# Altium schematic sheet can-rs232.SchDoc: can-rs232
size 582 x 469 mm; Origin: Eagle; Date: 4/18/2023 7:39:10 AM; SheetNumber: 1; GateName_1: G$1; SymbolName_1: FRAME_C_L; LibraryName: frames; DeviceSetName: FRAME_C_L; GateName_2: G$2; SymbolName_2: DOCFIELD; Sheet: Sheet:; REV: REV:
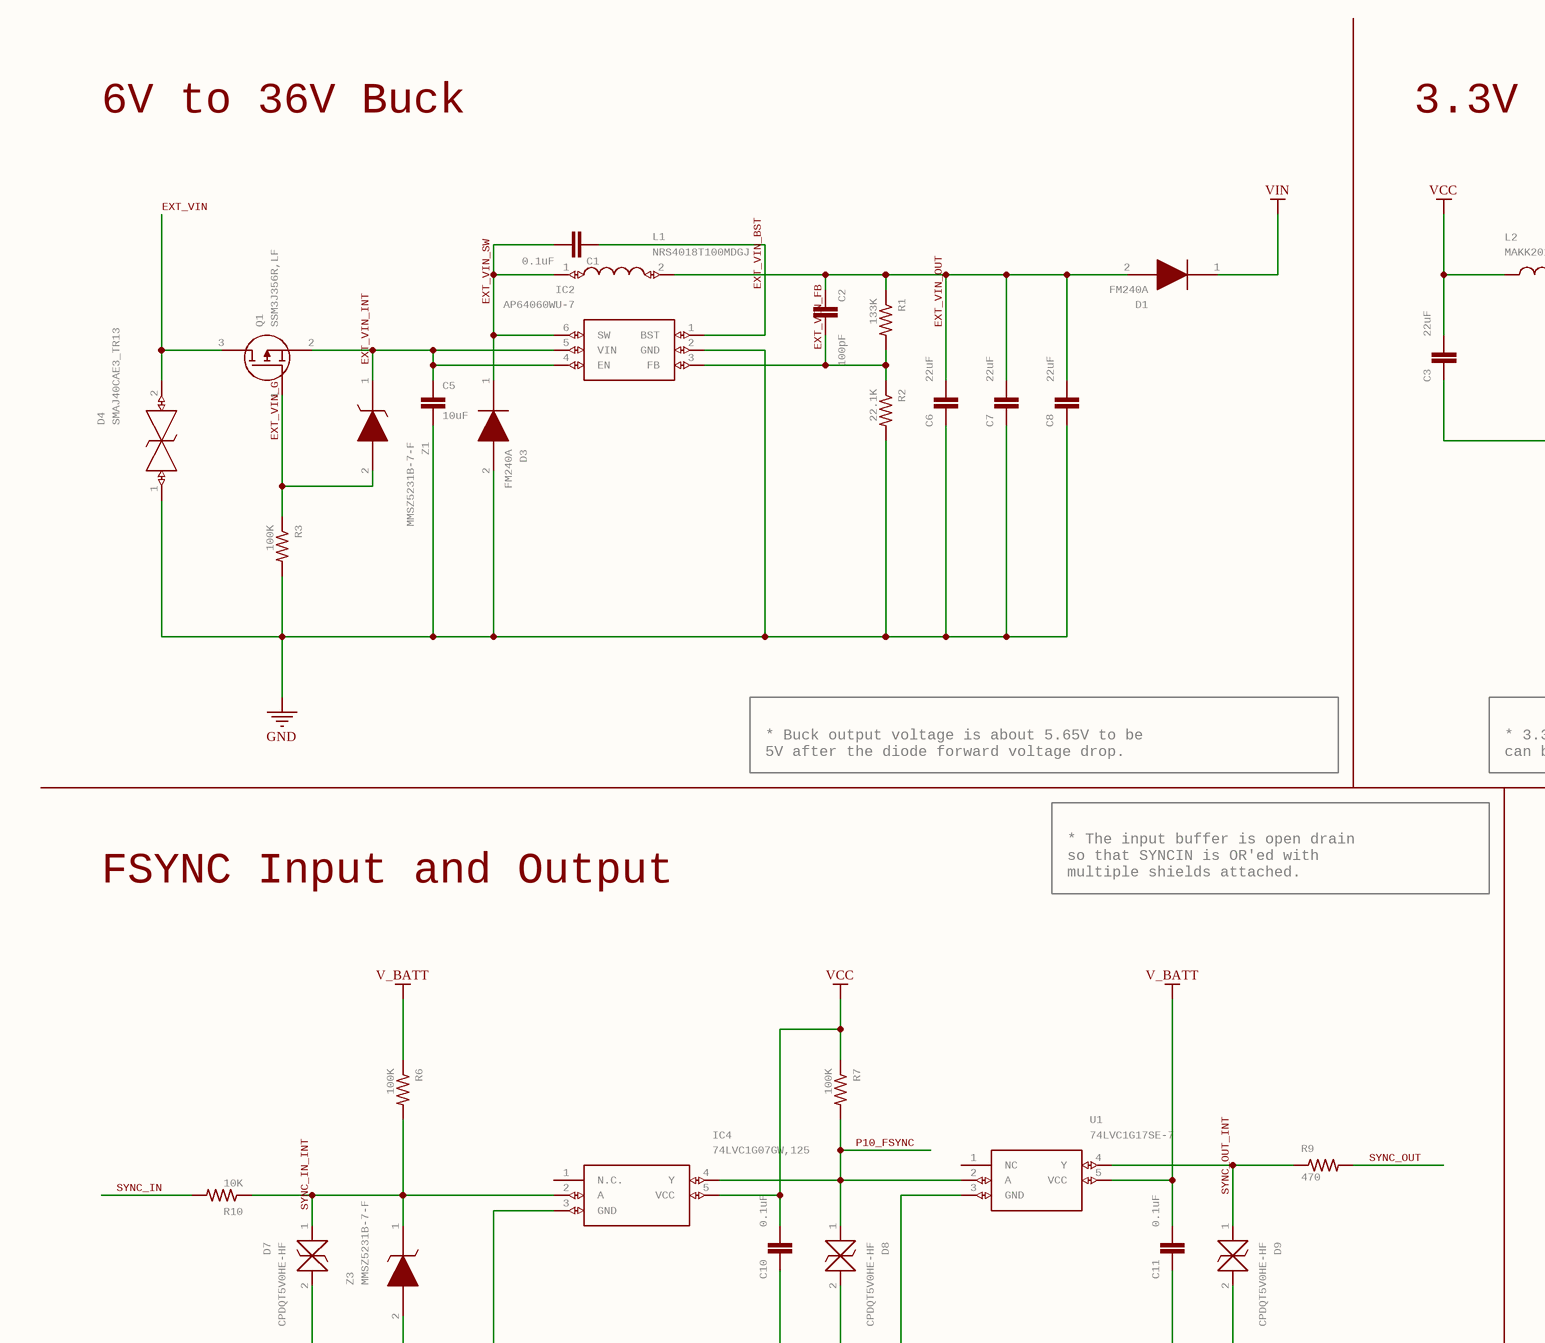
[diagram p0: can-rs232.SchDoc, top left]
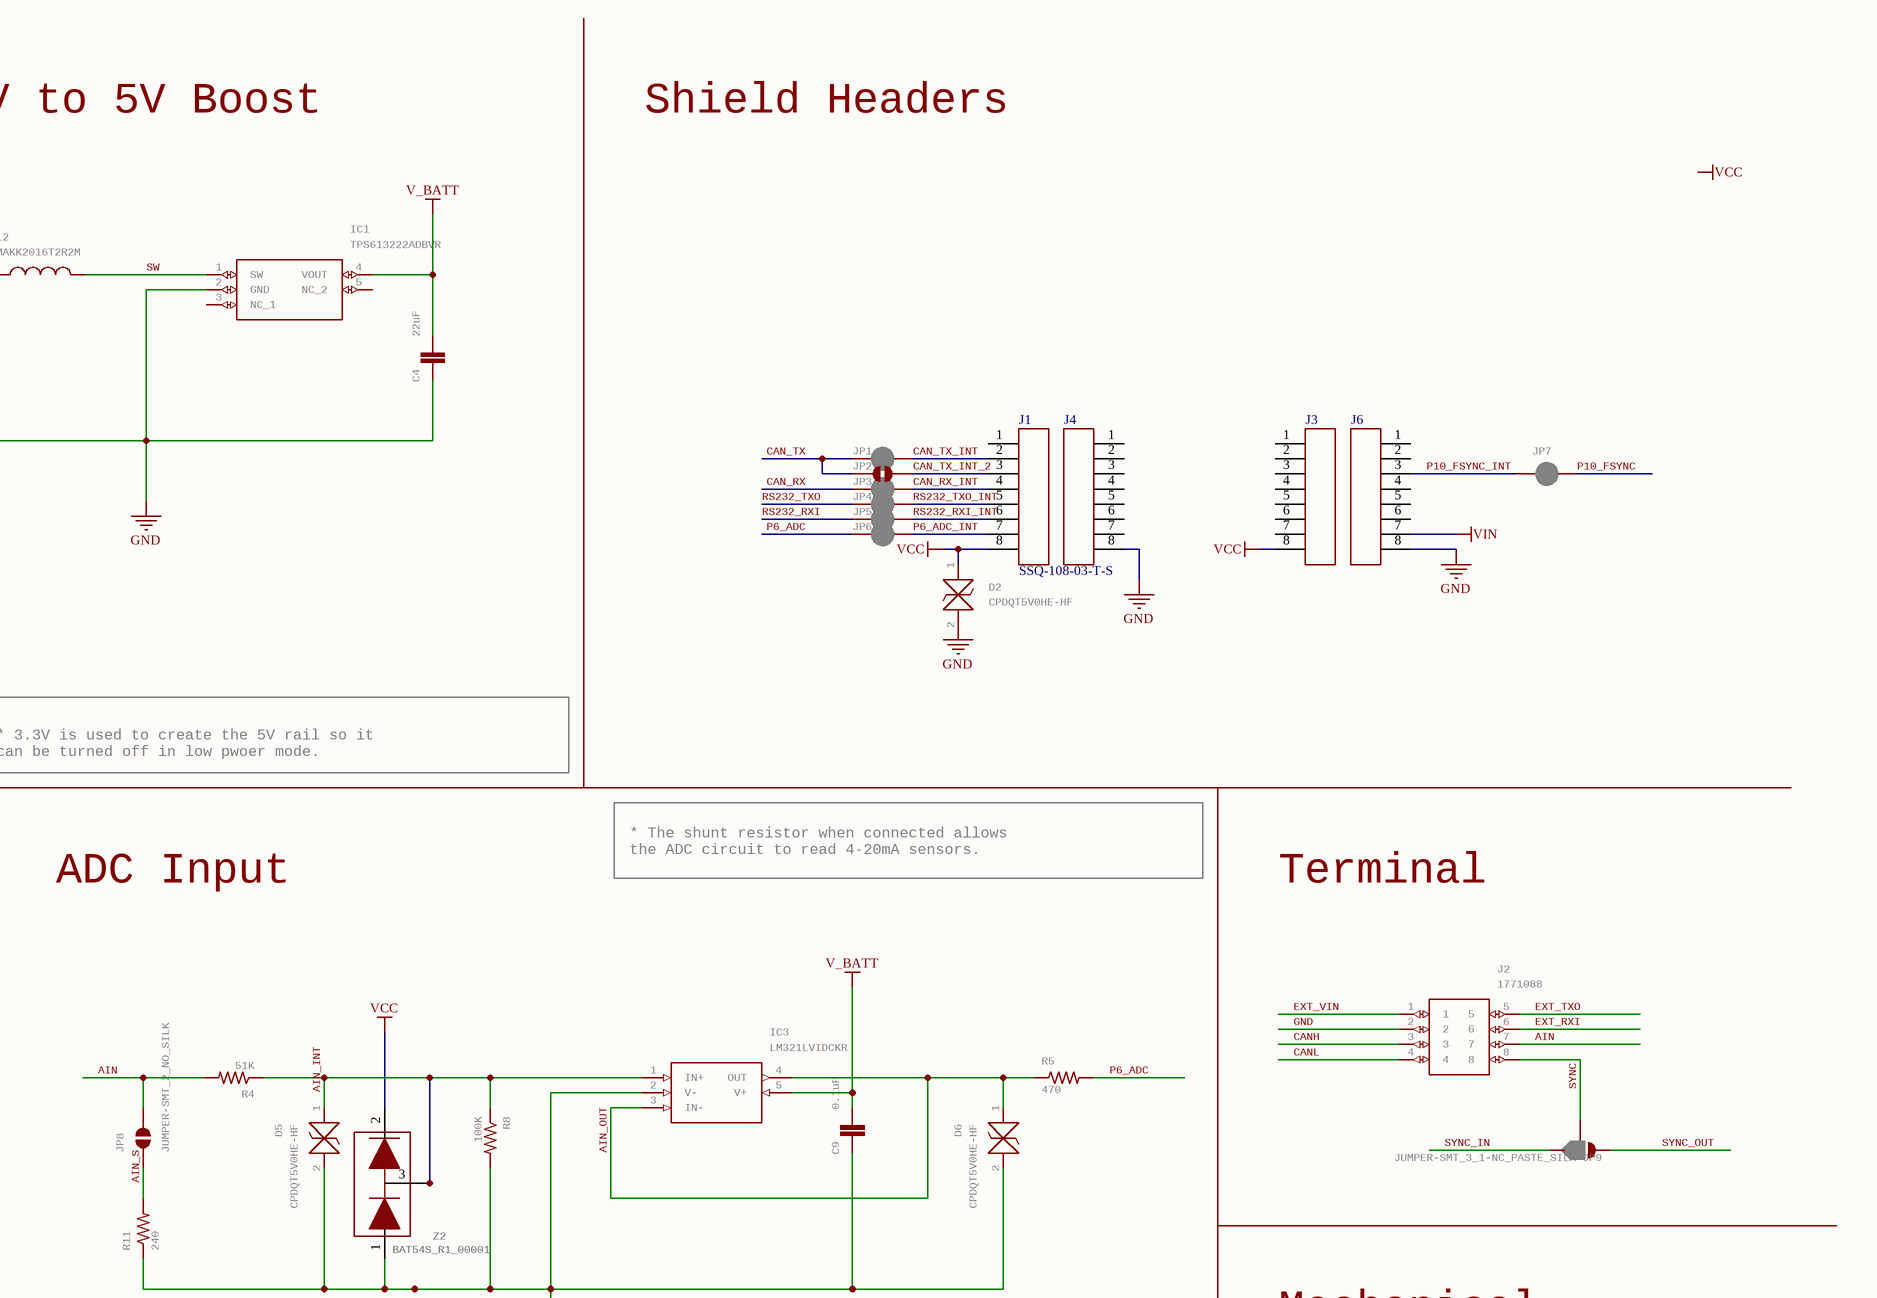
[diagram p1: can-rs232.SchDoc, top right]
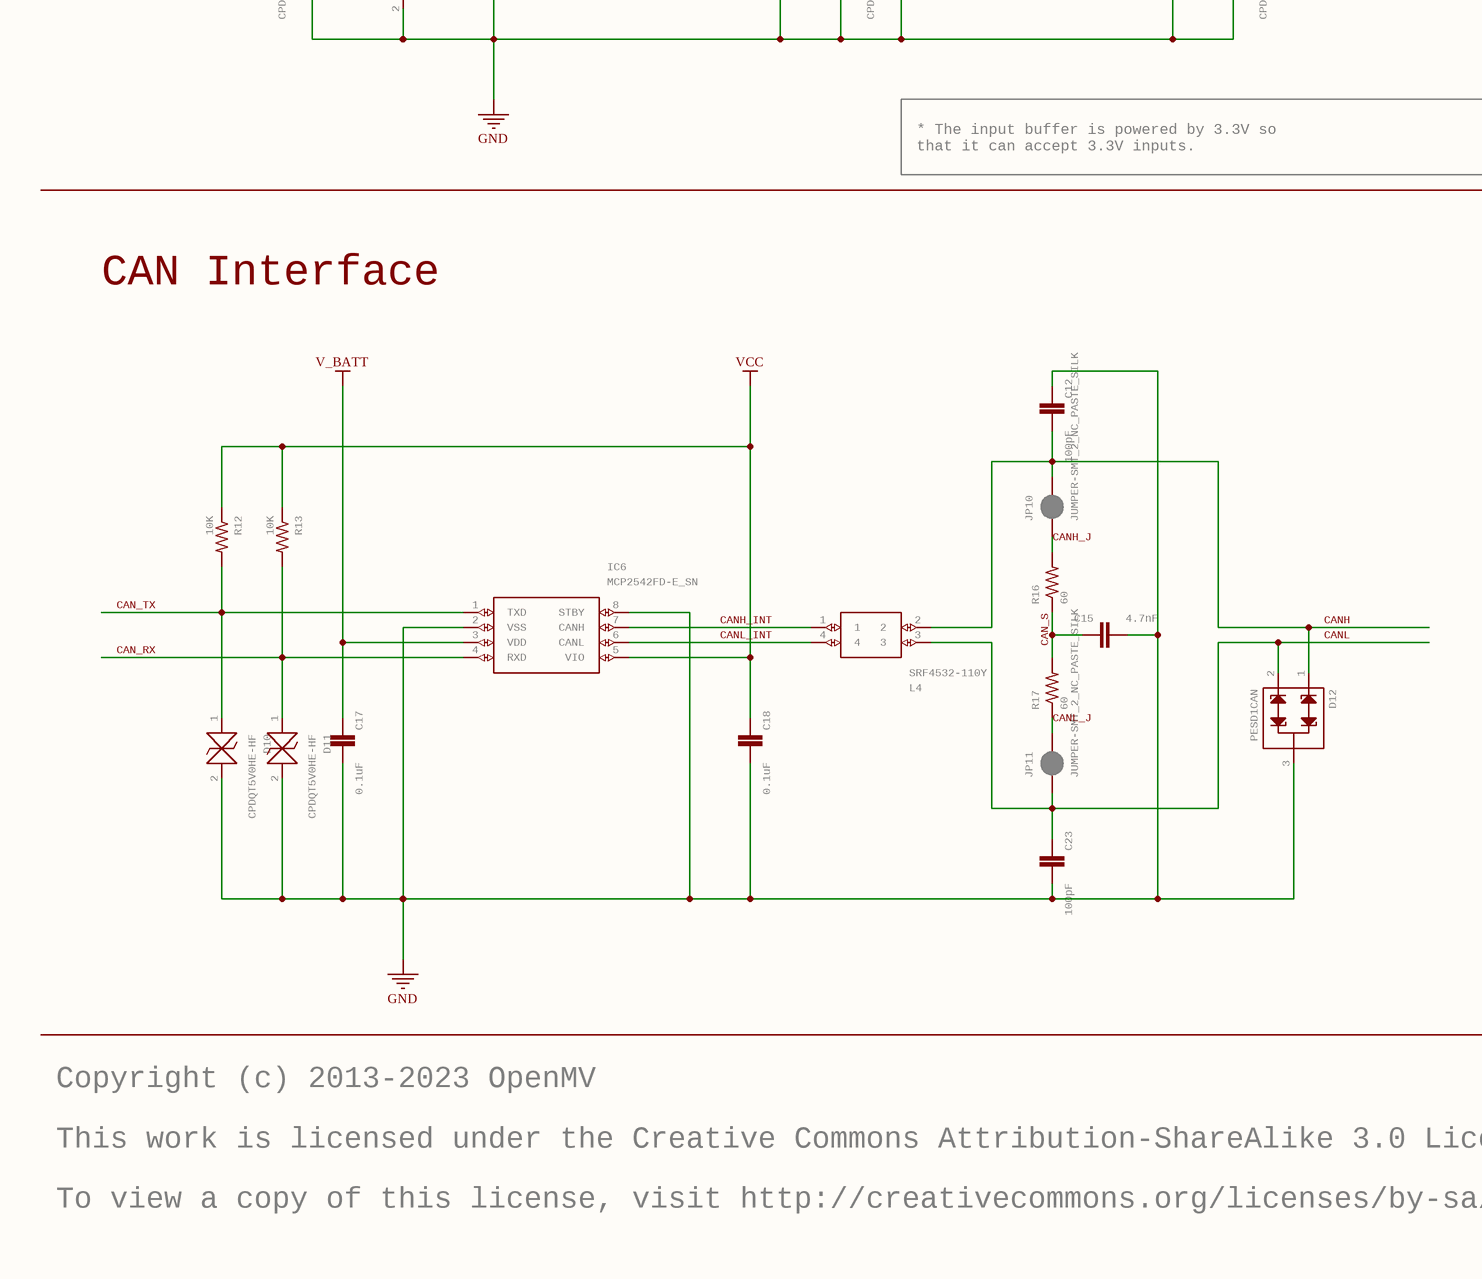
[diagram p2: can-rs232.SchDoc, bottom left]
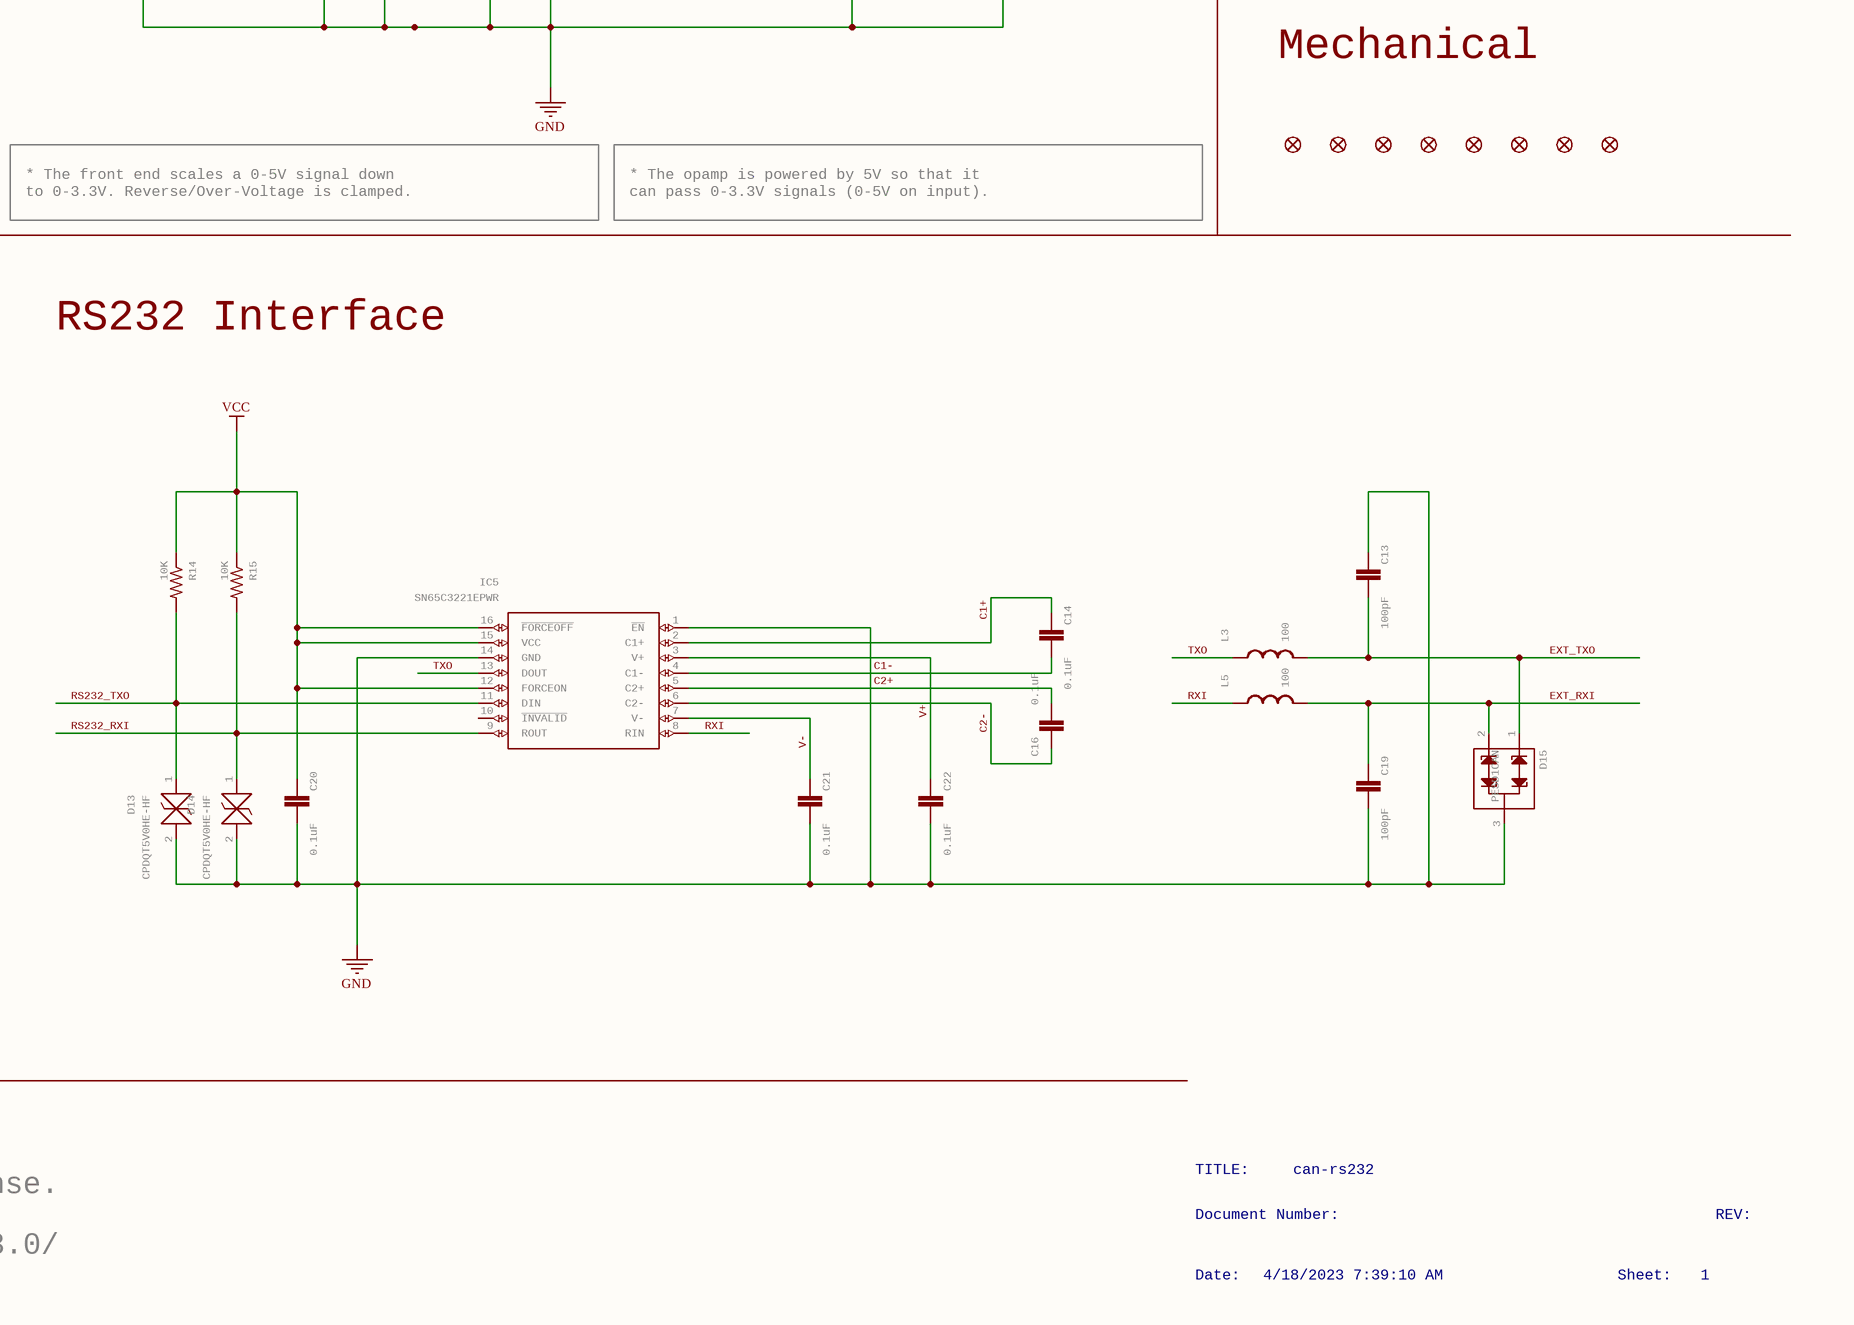
[diagram p3: can-rs232.SchDoc, bottom right]

## Parts
C1  0.1uF  [0402-CAP]
C2  100pF  [0402-CAP]
C3  22uF  [0805]
C4  22uF  [0805]
C5  10uF  [C0805]
C6  22uF  [0805]
C7  22uF  [0805]
C8  22uF  [0805]
C9  0.1uF  [0402-CAP]
C10  0.1uF  [0402-CAP]
C11  0.1uF  [0402-CAP]
C12  100pF  [0402-CAP]
C13  100pF  [0402-CAP]
C14  0.1uF  [0402-CAP]
C15  4.7nF  [0402-CAP]
C16  0.1uF  [0402-CAP]
C17  0.1uF  [0402-CAP]
C18  0.1uF  [0402-CAP]
C19  100pF  [0402-CAP]
C20  0.1uF  [0402-CAP]
C21  0.1uF  [0402-CAP]
C22  0.1uF  [0402-CAP]
C23  100pF  [0402-CAP]
D1  FM240A  [DIOM5025X231N]
D2  CPDQT5V0HE-HF  [CPDQT5V0HEHF]
D3  FM240A  [DIOM5025X231N]
D4  SMAJ40CAE3_TR13  [SMAJ40CAE3TR13]
D5  CPDQT5V0HE-HF  [CPDQT5V0HEHF]
D6  CPDQT5V0HE-HF  [CPDQT5V0HEHF]
D7  CPDQT5V0HE-HF  [CPDQT5V0HEHF]
D8  CPDQT5V0HE-HF  [CPDQT5V0HEHF]
D9  CPDQT5V0HE-HF  [CPDQT5V0HEHF]
D10  CPDQT5V0HE-HF  [CPDQT5V0HEHF]
D11  CPDQT5V0HE-HF  [CPDQT5V0HEHF]
D12  PESD1CAN  [SOT23-3]
D13  CPDQT5V0HE-HF  [CPDQT5V0HEHF]
D14  CPDQT5V0HE-HF  [CPDQT5V0HEHF]
D15  PESD1CAN  [SOT23-3]
FD1  FIDUCIAL1X2  [FIDUCIAL-1X2]  (value not drawn)
FD2  FIDUCIAL1X2  [FIDUCIAL-1X2]  (value not drawn)
FD3  FIDUCIAL1X2  [FIDUCIAL-1X2]  (value not drawn)
FD4  FIDUCIAL1X2  [FIDUCIAL-1X2]  (value not drawn)
FD5  FIDUCIAL1X2  [FIDUCIAL-1X2]  (value not drawn)
FD6  FIDUCIAL1X2  [FIDUCIAL-1X2]  (value not drawn)
FD7  FIDUCIAL1X2  [FIDUCIAL-1X2]  (value not drawn)
FD8  FIDUCIAL1X2  [FIDUCIAL-1X2]  (value not drawn)
IC1  TPS613222ADBVR  [SOT95P280X145-5N]
IC2  AP64060WU-7  [SOT95P280X100-6N]
IC3  LM321LVIDCKR  [SOT65P210X110-5N]
IC4  74LVC1G07GW,125  [SOT65P212X110-5N]
IC5  SN65C3221EPWR  [SOP65P640X120-16N]
IC6  MCP2542FD-E_SN  [SOIC127P600X175-8N]
J1  SSQ-108-03-T-S  [HDR_1X8]
J2  1771088  [1771088]
J3  SSQ-108-03-T-S  [HDR_1X8]  (value not drawn)
J4  SSQ-108-03-T-S  [HDR_1X8]  (value not drawn)
J6  SSQ-108-03-T-S  [HDR_1X8]  (value not drawn)
JP1  JUMPER-SMT_2_NC_PASTE_SILK  [SMT-JUMPER_2_NC_PASTE_SILK]  (value not drawn)
JP2  JUMPER-SMT_2_NO_SILK  [SMT-JUMPER_2_NO_SILK]  (value not drawn)
JP3  JUMPER-SMT_2_NC_PASTE_SILK  [SMT-JUMPER_2_NC_PASTE_SILK]  (value not drawn)
JP4  JUMPER-SMT_2_NC_PASTE_SILK  [SMT-JUMPER_2_NC_PASTE_SILK]  (value not drawn)
JP5  JUMPER-SMT_2_NC_PASTE_SILK  [SMT-JUMPER_2_NC_PASTE_SILK]  (value not drawn)
JP6  JUMPER-SMT_2_NC_PASTE_SILK  [SMT-JUMPER_2_NC_PASTE_SILK]  (value not drawn)
JP7  JUMPER-SMT_2_NC_PASTE_SILK  [SMT-JUMPER_2_NC_PASTE_SILK]  (value not drawn)
JP8  JUMPER-SMT_2_NO_SILK  [SMT-JUMPER_2_NO_SILK]
JP9  JUMPER-SMT_3_1-NC_PASTE_SILK  [SMT-JUMPER_3_1-NC_PASTE_SILK]
JP10  JUMPER-SMT_2_NC_PASTE_SILK  [SMT-JUMPER_2_NC_PASTE_SILK]
JP11  JUMPER-SMT_2_NC_PASTE_SILK  [SMT-JUMPER_2_NC_PASTE_SILK]
L1  NRS4018T100MDGJ  [NRS4018T100MDGJ]
L2  MAKK2016T2R2M  [INDC2016X100N]
L3  100  [C0402]
L4  SRF4532-110Y  [SRF4532101Y]
L5  100  [C0402]
Q1  SSM3J356R,LF  [SOTFL95P240X88-3N]
R1  133K  [0402-RES]
R2  22.1K  [0402-RES]
R3  100K  [0402-RES]
R4  51K  [0402-RES]
R5  470  [R0603]
R6  100K  [0402-RES]
R7  100K  [0402-RES]
R8  100K  [0402-RES]
R9  470  [R0603]
R10  10K  [0402-RES]
R11  240  [R0603]
R12  10K  [0402-RES]
R13  10K  [0402-RES]
R14  10K  [0402-RES]
R15  10K  [0402-RES]
R16  60  [R1206]
R17  60  [R1206]
U1  74LVC1G17SE-7  [SOT65P210X110-5N]
Z1  MMSZ5231B-7-F  [SOD3716X145N]
Z2  BAT54S_R1_00001  [SOT23-3]
Z3  MMSZ5231B-7-F  [SOD3716X145N]

## Nets
GND: C3.1 C4.1 C5.2 C6.1 C7.1 C8.1 C9.1 C10.1 C11.1 C12.1 C13.1 C15.2 C17.2 C18.2 C19.2 C20.2 C21.2 C22.2 C23.2 D2.2 D3.2(A) D4.1 D5.2 D6.2 D7.2 D8.2 D9.2 D10.2 D11.2 D12.3 D13.2 D14.2 D15.3 IC1.2(GND) IC2.2(GND) IC3.2(V-) IC4.3(GND) IC5.1(~{EN}) IC5.14(GND) IC6.2(VSS) IC6.8(STBY) J2.2 J4.8 J6.8 R2.2 R3.2 R8.2 R11.1 U1.3(GND) Z2.1 Z3.2(A)
V_BATT: C4.2 C9.2 C11.2 C17.1 IC1.4(VOUT) IC3.5(V+) IC6.3(VDD) R6.1 U1.5(VCC)
VCC: C3.2 C10.2 C18.1 C20.1 D2.1 IC4.5(VCC) IC5.12(FORCEON) IC5.15(VCC) IC5.16(~{FORCEOFF}) IC6.5(VIO) J1.8 J3.8 L2.1 R7.1 R12.1 R13.1 R14.1 R15.1 Z2.2
VIN: D1.1(K) J6.7
AIN: J2.7 JP8.2 R4.2
AIN_INT: D5.1 IC3.1(IN+) R4.1 R8.1 Z2.3
AIN_OUT: D6.1 IC3.3(IN-) IC3.4(OUT) R5.1
AIN_S: JP8.1 R11.2
C1+: C14.1 IC5.2(C1+)
C1-: C14.2 IC5.4(C1-)
C2+: C16.2 IC5.5(C2+)
C2-: C16.1 IC5.6(C2-)
CAN_RX: D11.1 IC6.4(RXD) JP3.1 R13.2
CAN_RX_INT: J1.4 JP3.2
CAN_S: C15.1 R16.1 R17.2
CAN_TX: D10.1 IC6.1(TXD) JP1.2 JP2.2 R12.2
CAN_TX_INT: J1.2 JP1.1
CAN_TX_INT_2: J1.3 JP2.1
CANH: C12.2 D12.1 J2.3 JP10.2 L4.2
CANH_INT: IC6.7(CANH) L4.1
CANH_J: JP10.1 R16.2
CANL: C23.1 D12.2 J2.4 JP11.1 L4.3
CANL_INT: IC6.6(CANL) L4.4
CANL_J: JP11.2 R17.1
EXT_RXI: C19.1 D15.2 J2.6 L5.2
EXT_TXO: C13.2 D15.1 J2.5 L3.2
EXT_VIN: D4.2 J2.1 Q1.3(D)
EXT_VIN_BST: C1.1 IC2.1(BST)
EXT_VIN_FB: C2.2 IC2.3(FB) R1.2 R2.1
EXT_VIN_G: Q1.1(G) R3.1 Z1.2(A)
EXT_VIN_INT: C5.1 IC2.4(EN) IC2.5(VIN) Q1.2(S) Z1.1(K)
EXT_VIN_OUT: C2.1 C6.2 C7.2 C8.2 D1.2(A) L1.2 R1.1
EXT_VIN_SW: C1.2 D3.1(K) IC2.6(SW) L1.1
P6_ADC: JP6.2 R5.2
P6_ADC_INT: J1.7 JP6.1
P10_FSYNC: D8.1 IC4.4(Y) JP7.2 R7.2 U1.2(A)
P10_FSYNC_INT: J6.3 JP7.1
RS232_RXI: D14.1 IC5.9(ROUT) JP5.2 R15.2
RS232_RXI_INT: J1.6 JP5.1
RS232_TXO: D13.1 IC5.11(DIN) JP4.2 R14.2
RS232_TXO_INT: J1.5 JP4.1
RXI: IC5.8(RIN) L5.1
SW: IC1.1(SW) L2.2
SYNC: J2.8 JP9.2
SYNC_IN: JP9.3 R10.2
SYNC_IN_INT: D7.1 IC4.2(A) R6.2 R10.1 Z3.1(K)
SYNC_OUT: JP9.1 R9.2
SYNC_OUT_INT: D9.1 R9.1 U1.4(Y)
TXO: IC5.13(DOUT) L3.1
V+: C22.1 IC5.3(V+)
V-: C21.1 IC5.7(V-)

Not connected (* = marked no-connect by the designer): IC1 3(NC_1) 5(NC_2); IC4 1(N.C.); IC5 10(~{INVALID}); J1 1; J3 1 2 3 4 5 6 7; J4 1 2 3 4 5 6 7; J6 1 2 4 5 6; U1 1(NC)

## Notes on the sheet
- 6V to 36V Buck
- 3.3V to 5V Boost
- Shield Headers
- * Buck output voltage is about 5.65V to be
  5V after the diode forward voltage drop.
- * 3.3V is used to create the 5V rail so it
  can be turned off in low pwoer mode.
- * The shunt resistor when connected allows
  the ADC circuit to read 4-20mA sensors.
- FSYNC Input and Output
- * The input buffer is open drain
  so that SYNCIN is OR'ed with
  multiple shields attached.
- ADC Input
- Terminal
- Mechanical
- * The input buffer is powered by 3.3V so
  that it can accept 3.3V inputs.
- * The front end scales a 0-5V signal down
  to 0-3.3V. Reverse/Over-Voltage is clamped.
- * The opamp is powered by 5V so that it
  can pass 0-3.3V signals (0-5V on input).
- CAN Interface
- RS232 Interface
- Copyright (c) 2013-2023 OpenMV
- TITLE:
- can-rs232
- This work is licensed under the Creative Commons Attribution-ShareAlike 3.0 License.
- To view a copy of this license, visit http://creativecommons.org/licenses/by-sa/3.0/
- Document Number:
- REV:
- Date:
- 4/18/2023 7:39:10 AM
- Sheet:
- 1
- Labels drawn without touching a wire or pin: VCC

## Library data of the parts
C1 C9-C11 C14 C16-C18 C20-C22 = CAP0402-CAP: CapacitorStandard 0603 ceramic capacitor, and 0.1" leaded capacitor.; MPN: GRM155R71H104KE14D; GateName_1: G$1; SymbolName_1: CAP; DeviceName: 0402-CAP; LibraryName: sfe; DeviceSetName: CAP
C2 C12 C13 C19 C23 = CAP0402-CAP: CapacitorStandard 0603 ceramic capacitor, and 0.1" leaded capacitor.; MPN: CC0402JRNPO9BN101; GateName_1: G$1; SymbolName_1: CAP; DeviceName: 0402-CAP; LibraryName: sfe; DeviceSetName: CAP
C3 C4 C6-C8 = 22UF-0805-6.3V-20%: 22ÂµF ceramic capacitors    A capacitor is a passive two-terminal electrical component used to store electrical energy temporarily in an electric field.; MPN: CL21A226MQQNNNE; GateName_1: G$1; SymbolName_1: CAP; PROD_ID: CAP-08402; DeviceName: -0805-6.3V-20%; LibraryName: SparkFun-Capacitors; DeviceSetName: 22UF
C5 = C-EUC0805: CAPACITOR, European symbol; MPN: GRM21BR61H106KE43K; GateName_1: G$1; SymbolName_1: C-EU; POPULARITY: 88; DeviceName: C0805; LibraryName: rcl; DeviceSetName: C-EU; SPICEPREFIX: C
C15 = CAP0402-CAP: CapacitorStandard 0603 ceramic capacitor, and 0.1" leaded capacitor.; MPN: GRM155R71H472JA01D; GateName_1: G$1; SymbolName_1: CAP; DeviceName: 0402-CAP; LibraryName: sfe; DeviceSetName: CAP
D1 D3 = FM240A: Diodes - General Purpose, Power, Switching GP Si Rectifier SMB,2A,40V   Source:  Datasheet; MANUFACTURER_NAME: Rectron; GateName_1: G$1; SymbolName_1: FM240A; LibraryName: FM240A; DeviceSetName: FM240A; HEIGHT: 2.31mm; MANUFACTURER_PART_NUMBER: FM240A; MOUSER_PART_NUMBER: 583-FM240A; MOUSER_PRICE-STOCK: https://www.mouser.co.uk/ProductDetail/Rectron/FM240A?qs=7pEAo90IqNG7sknZwmLYhQ%3D%3D; MPN: FM240A
D2 D5-D11 D13 D14 = CPDQT5V0HE-HF: ESD Suppressors / TVS Diodes DIODE ESD 5VWM 65W 0402/SOD-923F   Source:  Datasheet; MANUFACTURER_NAME: Comchip Technology; GateName_1: G$1; SymbolName_1: CPDQT5V0HE-HF; LibraryName: CPDQT5V0HE-HF; DeviceSetName: CPDQT5V0HE-HF; HEIGHT: 0.42mm; MANUFACTURER_PART_NUMBER: CPDQT5V0HE-HF; MOUSER_PART_NUMBER: MOUSER_PART_NUMBER; MOUSER_PRICE-STOCK: MOUSER_PRICE-STOCK; MPN: CPDQT5V0HE-HF
D4 = SMAJ40CAE3_TR13: ESD Suppressors / TVS Diodes TVS   Source:  Datasheet; MANUFACTURER_NAME: Microchip; MANUFACTURER_PART_NUMBER: SMAJ40CAe3/TR13; GateName_1: G$1; SymbolName_1: SMAJ40CAE3_TR13; LibraryName: SMAJ40CAe3_TR13; DeviceSetName: SMAJ40CAE3_TR13; HEIGHT: 3.05mm; MOUSER_PART_NUMBER: 494-SMAJ40CAE3/TR13; MOUSER_PRICE-STOCK: https://www.mouser.co.uk/ProductDetail/Microchip-Technology/SMAJ40CAe3-TR13?qs=pU29NIZ4ZwCw3PnlxOleOw%3D%3D; MPN: SMAJ40CAe3/TR13
D12 D15 = PESD1CAN: CAN bus ESD protection diode    PESD1CAN is used to protect two CAN bus lines from ESD.   Link to datasheet   SparkFun Products: SparkFun CAN-BUS Shield; MPN: VCAN36A2-03S-E3-08; GateName_1: G$1; SymbolName_1: PESD1CAN_DIODE; PROD_ID: DIO-12501; LibraryName: SparkFun-DiscreteSemi; DeviceSetName: PESD1CAN
FD1-FD8 = FIDUCIAL1X2: Fiducial Alignment Points    Point-of-reference for pick-and-place machines and other optical instruments.; GateName_1: G$1; DeviceName: 1X2; SymbolName_1: FIDUCIAL; LibraryName: SparkFun-Aesthetics; DeviceSetName: FIDUCIAL
IC1 = TPS613222ADBVR: 6-uA Quiescent Current, 1.8-A Switch Current Boost Converter   Source:  Datasheet; MANUFACTURER_NAME: Texas Instruments; GateName_1: G$1; SymbolName_1: TPS613222ADBVR; LibraryName: TPS613222ADBVR; DeviceSetName: TPS613222ADBVR; HEIGHT: 1.45mm; MANUFACTURER_PART_NUMBER: TPS613222ADBVR; MOUSER_PART_NUMBER: 595-TPS613222ADBVR; MOUSER_PRICE-STOCK: https://www.mouser.co.uk/ProductDetail/Texas-Instruments/TPS613222ADBVR?qs=W0yvOO0ixfE4d69WXsn8NQ%3D%3D; MPN: TPS613222ADBVR
IC2 = AP64060WU-7: Switching Voltage Regulators DCDC Conv HV Buck TSOT26(STD) T&R 3K   Source:  Datasheet; MANUFACTURER_NAME: Diodes Inc.; GateName_1: G$1; SymbolName_1: AP64060WU-7; LibraryName: AP64060WU-7; DeviceSetName: AP64060WU-7; HEIGHT: 1mm; MANUFACTURER_PART_NUMBER: AP64060WU-7; MOUSER_PART_NUMBER: 621-AP64060WU-7; MOUSER_PRICE-STOCK: https://www.mouser.co.uk/ProductDetail/Diodes-Incorporated/AP64060WU-7?qs=Li%252BoUPsLEntiZYjFw%252BCbiQ%3D%3D; MPN: AP64060WU-7
IC3 = LM321LVIDCKR: 1-Channel industry standard low voltage operational amplifier   Source:  Datasheet; MANUFACTURER_NAME: Texas Instruments; GateName_1: G$1; SymbolName_1: LM321LVIDCKR; LibraryName: LM321LVIDCKR; DeviceSetName: LM321LVIDCKR; HEIGHT: 1.1mm; MANUFACTURER_PART_NUMBER: LM321LVIDCKR; MOUSER_PART_NUMBER: 595-LM321LVIDCKR; MOUSER_PRICE-STOCK: https://www.mouser.co.uk/ProductDetail/Texas-Instruments/LM321LVIDCKR?qs=qSfuJ%252Bfl%2Fd6RcyTOjkRx5Q%3D%3D; MPN: LM321LVIDCKR
IC4 = 74LVC1G07GW,125: 74LVC1G07 - Buffer with open-drain output@en-us   Source:  Datasheet; MANUFACTURER_NAME: Nexperia; GateName_1: G$1; SymbolName_1: 74LVC1G07GW,125; LibraryName: 74LVC1G07GW_125; DeviceSetName: 74LVC1G07GW,125; HEIGHT: 1.1mm; MANUFACTURER_PART_NUMBER: 74LVC1G07GW,125; MOUSER_PART_NUMBER: 771-74LVC1G07GW-G; MOUSER_PRICE-STOCK: https://www.mouser.co.uk/ProductDetail/Nexperia/74LVC1G07GW125?qs=me8TqzrmIYW763Mg%2FG86Uw%3D%3D; MPN: 74LVC1G07GW,125
IC5 = SN65C3221EPWR: 3-V To 5.5-V Single Channel RS-232 1 Mbit/s Line Driver/Receiver   Source:  Datasheet; MANUFACTURER_NAME: Texas Instruments; GateName_1: G$1; SymbolName_1: SN65C3221EPWR; LibraryName: SN65C3221EPWR; DeviceSetName: SN65C3221EPWR; HEIGHT: 1.2mm; MANUFACTURER_PART_NUMBER: SN65C3221EPWR; MOUSER_PART_NUMBER: 595-SN65C3221EPWR; MOUSER_PRICE-STOCK: https://www.mouser.co.uk/ProductDetail/Texas-Instruments/SN65C3221EPWR?qs=6siQ5y5nVCwNDulozFTH8A%3D%3D; MPN: SN65C3221EPWR
IC6 = MCP2542FD-E_SN: Microchip MCP2542FD-E/SN, CAN Transceiver 8Mbit/s 1-Channel CAN, ISO 11898-2, ISO 11898-5, ISO/DIS11898-2, 8-Pin SOIC   Source:  Datasheet; GateName_1: G$1; SymbolName_1: MCP2542FD-E_SN; LibraryName: MCP2542FD-E_SN; DeviceSetName: MCP2542FD-E_SN; HEIGHT: 1.75mm; MANUFACTURER_NAME: Microchip; MANUFACTURER_PART_NUMBER: MCP2542FD-E/SN; MOUSER_PART_NUMBER: 579-MCP2542FD-E/SN; MOUSER_PRICE-STOCK: https://www.mouser.co.uk/ProductDetail/Microchip-Technology-Atmel/MCP2542FD-E-SN?qs=qdgZG5p0FZ5pNizBl1u80Q%3D%3D; MPN: MCP2542FD-E/SN
J1 J3 J4 J6 = HDR_1X8: MANUFACTURER P/N: SSQ-108-03-T-S
J2 = 1771088: PCB terminal block, nominal current: 6 A, rated voltage (III/2): 160 V, nominal cross section: 0.5 mm?, Number of potentials: 8, Number of rows: 1, Number of positions per row: 8, product range: PTSM 0,5/..-H-SMD, pitch: 2.5 mm, connection method: Push-in spring connection, mounting: SMD soldering, conductor/PCB connection direction: 0 ?, color: black, Pin layout: Linear pad geometry, type of packaging: packed in cardboard   Source:  Datasheet; MANUFACTURER_NAME: Phoenix Contact; GateName_1: G$1; SymbolName_1: 1771088; LibraryName: 1771088; DeviceSetName: 1771088; HEIGHT: 5.22mm; MANUFACTURER_PART_NUMBER: 1771088; MOUSER_PART_NUMBER: 651-1771088; MOUSER_PRICE-STOCK: https://www.mouser.co.uk/ProductDetail/Phoenix-Contact/1771088?qs=Q77YN%2FRrsKIDMojcNKtpFQ%3D%3D; MPN: 1771088
JP1 JP3-JP7 JP10 JP11 = JUMPER-SMT_2_NC_PASTE_SILK: Normally closed solder jumper    This jumper has an aperture in the stencil to allow solder paste to bridge the split in the wire so it's normally closed (NC). Wick off the solder to open the connection. Reapply solder to reclose the connection.; GateName_1: G$1; SymbolName_1: SMT-JUMPER_2_NC_PASTE; DeviceName: _SILK; LibraryName: SparkFun-Jumpers; DeviceSetName: JUMPER-SMT_2_NC_PASTE
JP2 JP8 = JUMPER-SMT_2_NO_SILK: Normally open jumper    This jumper has two pads in close proximity to each other. Apply solder to close the connection.   Round pads are easier to solder for beginners, but are a lot larger.   SparkFun Product that uses the round pads:  SparkFun EL Sequencer; GateName_1: G$1; SymbolName_1: SMT-JUMPER_2_NO; DeviceName: _SILK; LibraryName: SparkFun-Jumpers; DeviceSetName: JUMPER-SMT_2_NO
JP9 = JUMPER-SMT_3_1-NC_PASTE_SILK: Normally closed solder jumper (1 of 2 connections)    This jumper has an aperture in the stencil to allow solder paste to bridge one of the two connections. One connection is normally closed (NC), while the other is normally open (NO). Wick off the solder to open the connection. Reapply solder to reclose the connection. Apply solder to the other side instead to change the current path.; GateName_1: G$1; SymbolName_1: SMT-JUMPER_3_1-NC_PASTE; DeviceName: _SILK; LibraryName: SparkFun-Jumpers; DeviceSetName: JUMPER-SMT_3_1-NC_PASTE
L1 = NRS4018T100MDGJ: Fixed Inductors 4018 10uH 180mOhms +/-20%Tol 1200mA   Source:  Datasheet; MANUFACTURER_NAME: TAIYO YUDEN; GateName_1: G$1; SymbolName_1: NRS4018T100MDGJ; LibraryName: NRS4018T100MDGJ; DeviceSetName: NRS4018T100MDGJ; HEIGHT: 1mm; MANUFACTURER_PART_NUMBER: NRS4018T100MDGJ; MOUSER_PART_NUMBER: 963-NRS4018T100MDGJ; MOUSER_PRICE-STOCK: https://www.mouser.co.uk/ProductDetail/TAIYO-YUDEN/NRS4018T100MDGJ?qs=PzICbMaShUeiyHfvjt6KEw%3D%3D; MPN: NRS4018T100MDGJ
L2 = MAKK2016T2R2M: INDUCTOR, METAL CORE Check availability; GateName_1: G$1; MF: Taiyo Yuden; SymbolName_1: MAKK2016T2R2M; LibraryName: MAKK2016T2R2M; DeviceSetName: MAKK2016T2R2M; AVAILABILITY: In Stock; MP: MAKK2016T2R2M; MPN: MAKK2016T2R2M; PACKAGE: 2016 Taiyo Yuden; PRICE: None; PURCHASE-URL: https://pricing.snapeda.com/search/part/MAKK2016T2R2M/?ref=eda
L3 L5 = INDUCTOR0402: InductorsBasic Inductor/Choke - 0603 and 1206. Footprints are not proven and vary greatly between part numbers.; MPN: MFBM1V1005-101-R; GateName_1: G$1; DeviceName: 0402; SymbolName_1: INDUCTOR; LibraryName: sfe; DeviceSetName: INDUCTOR
L4 = SRF4532-110Y: Bourns Type 4532 Wire-wound SMD Inductor with a Ferrite Core, 11 uH -30  +50% Wire-Wound 300mA Idc   Source:  Datasheet; GateName_1: G$1; SymbolName_1: SRF4532-110Y; LibraryName: SRF4532-110Y; DeviceSetName: SRF4532-110Y; HEIGHT: 3mm; MANUFACTURER_NAME: Bourns; MANUFACTURER_PART_NUMBER: SRF4532-110Y; MOUSER_PART_NUMBER: 652-SRF4532-110Y; MOUSER_PRICE-STOCK: https://www.mouser.co.uk/ProductDetail/Bourns/SRF4532-110Y?qs=u649AIwumF8o5t6hcAfmlw%3D%3D; MPN: SRF4532-110Y
Q1 = SSM3J356R,LF: MOSFET Small-signal MOSFET ID: -2A, VDSS: -60V   Source:  Datasheet; MANUFACTURER_NAME: Toshiba; GateName_1: G$1; SymbolName_1: SSM3J356R,LF; LibraryName: SSM3J356R_LF; DeviceSetName: SSM3J356R,LF; HEIGHT: 0.88mm; MANUFACTURER_PART_NUMBER: SSM3J356R,LF; MOUSER_PART_NUMBER: 757-SSM3J356RLF; MOUSER_PRICE-STOCK: https://www.mouser.co.uk/ProductDetail/Toshiba/SSM3J356RLF?qs=lhkzy8lC%252BSsL%2F1yLGjMnQA%3D%3D; MPN: SSM3J356R,LF
R1 = RESISTOR0402-RES: ResistorBasic schematic elements and footprints for 0603, 1206, and PTH resistors.; MPN: RC0402FR-07133KL; GateName_1: G$1; SymbolName_1: RESISTOR; DeviceName: 0402-RES; LibraryName: sfe; DeviceSetName: RESISTOR
R2 = RESISTOR0402-RES: ResistorBasic schematic elements and footprints for 0603, 1206, and PTH resistors.; MPN: CR0402-FX-2212GLF; GateName_1: G$1; SymbolName_1: RESISTOR; DeviceName: 0402-RES; LibraryName: sfe; DeviceSetName: RESISTOR
R3 R6-R8 = RESISTOR0402-RES: ResistorBasic schematic elements and footprints for 0603, 1206, and PTH resistors.; MPN: AC0402FR-07100KL; GateName_1: G$1; SymbolName_1: RESISTOR; DeviceName: 0402-RES; LibraryName: sfe; DeviceSetName: RESISTOR
R4 = RESISTOR0402-RES: ResistorBasic schematic elements and footprints for 0603, 1206, and PTH resistors.; MPN: RC0402JR-0751KL; GateName_1: G$1; SymbolName_1: RESISTOR; DeviceName: 0402-RES; LibraryName: sfe; DeviceSetName: RESISTOR
R5 R9 = R-US_R0603: RESISTOR, American symbol; MPN: CR0603-FX-4700ELF; GateName_1: G$1; SymbolName_1: R-US; DeviceSetName: R-US_; POPULARITY: 77; DeviceName: R0603; LibraryName: rcl; SPICEPREFIX: R
R10 R12-R15 = RESISTOR0402-RES: ResistorBasic schematic elements and footprints for 0603, 1206, and PTH resistors.; MPN: AC0402FR-1310KL; GateName_1: G$1; SymbolName_1: RESISTOR; DeviceName: 0402-RES; LibraryName: sfe; DeviceSetName: RESISTOR
R11 = R-US_R0603: RESISTOR, American symbol; MPN: RK73B1JTTD241J; GateName_1: G$1; SymbolName_1: R-US; DeviceSetName: R-US_; POPULARITY: 77; DeviceName: R0603; LibraryName: rcl; SPICEPREFIX: R
R16 R17 = R-US_R1206: RESISTOR, American symbol; MPN: RC1206FR-0760R4L; GateName_1: G$1; SymbolName_1: R-US; DeviceSetName: R-US_; POPULARITY: 19; DeviceName: R1206; LibraryName: rcl; SPICEPREFIX: R
U1 = 74LVC1G17SE-7: DiodesZetex 74LVC1G17SE-7, Buffer, Push-Pull, Non-Inverting, 1.65  5.5 V, 5-Pin SOT-353   Source:  Datasheet; MANUFACTURER_NAME: Diodes Inc.; GateName_1: G$1; SymbolName_1: 74LVC1G17SE-7; LibraryName: 74LVC1G17SE-7; DeviceSetName: 74LVC1G17SE-7; HEIGHT: 1.1mm; MANUFACTURER_PART_NUMBER: 74LVC1G17SE-7; MOUSER_PART_NUMBER: 621-74LVC1G17SE-7; MOUSER_PRICE-STOCK: https://www.mouser.co.uk/ProductDetail/Diodes-Incorporated/74LVC1G17SE-7?qs=FRHfhEBFk1dzIcstjqNcyA%3D%3D; MPN: 74LVC1G17SE-7
Z1 Z3 = MMSZ5231B-7-F: Zener Diode 5.1V 5% 500mW SOD123 Diodes Inc MMSZ5231B-7-F Zener Diode, 5.1V 5% 0.5 W SMT 2-Pin SOD-123   Source:  Datasheet; MANUFACTURER_NAME: Diodes Inc.; GateName_1: G$1; SymbolName_1: MMSZ5231B-7-F; LibraryName: MMSZ5231B-7-F; DeviceSetName: MMSZ5231B-7-F; HEIGHT: 1.45mm; MANUFACTURER_PART_NUMBER: MMSZ5231B-7-F; MOUSER_PART_NUMBER: 621-MMSZ5231B-F; MOUSER_PRICE-STOCK: https://www.mouser.co.uk/ProductDetail/Diodes-Incorporated/MMSZ5231B-7-F?qs=2ygBApjwyeMh7Sf0YL1qSw%3D%3D; MPN: MMSZ5231B-7-F